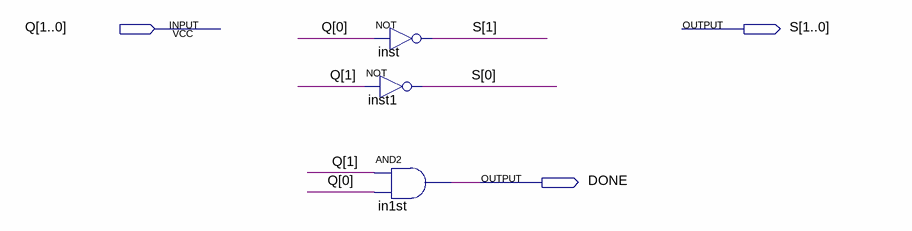
[diagram p0: schematic sheet]
// Quartus schematic OUTPUT_ENCODER.bdf as structural Verilog: 3 symbols, 3 pins
module OUTPUT_ENCODER (
  input  [1:0] Q,
  output [1:0] S,
  output DONE
);

  not inst (S[1], Q[0]);
  not inst1 (S[0], Q[1]);
  and in1st (DONE, Q[1], Q[0]);
endmodule
